# Altium schematic sheet ATmega328-ED.SchDoc: ATmega328 ED
size B; Author: Quadro; Revision: 1.0.0; SheetNumber: 1; SheetTotal: 1
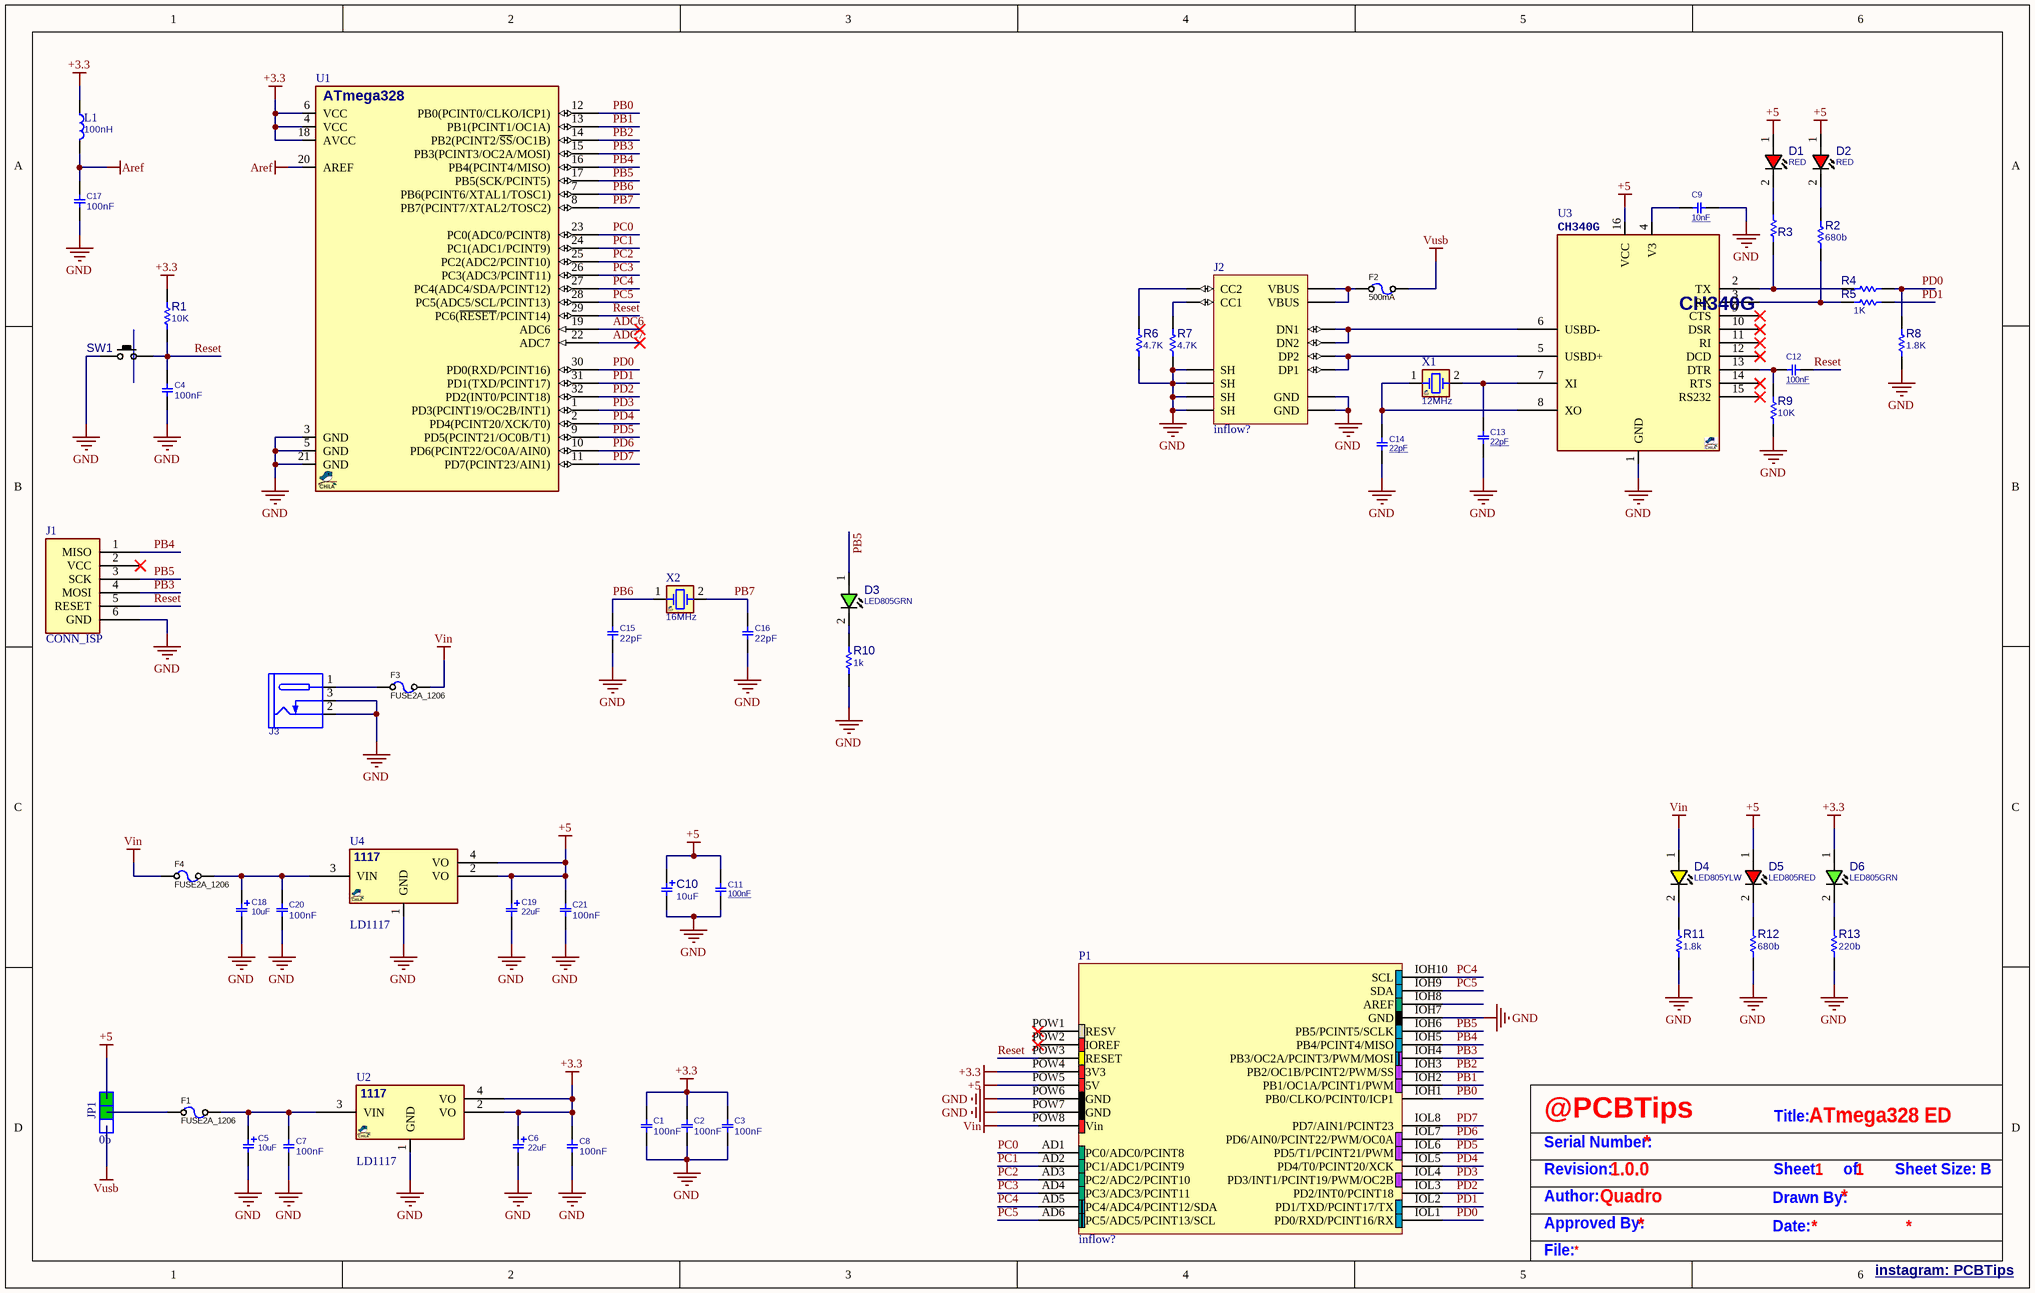
[diagram p0: ATmega328-ED.SchDoc]

## Parts
C1  100nF  [C0805]
C2  100nF  [C0805]
C3  100nF  [C0805]
C4  100nF  [C0805]
C5  10uF  [C_TN_2012]
C6  22uF  [C_TN_2012]
C7  100nF  [C1206]
C8  100nF  [C1206]
C9  10nF  [C1206]
C10  10uF  [C_EL_D4L5]
C11  100nF  [C1206]
C12  100nF  [C1206]
C13  22pF  [C1206]
C14  22pF  [C1206]
C15  22pF  [C0805]
C16  22pF  [C0805]
C17  100nF  [C0805]
C18  10uF  [C_TN_2012]
C19  22uF  [C_TN_2012]
C20  100nF  [C1206]
C21  100nF  [C1206]
D1  RED  [LED0805RED]
D2  RED  [LED0805RED]
D3  LED805GRN  [LED0805GRN]
D4  LED805YLW  [LED0805YLW]
D5  LED805RED  [LED0805RED]
D6  LED805GRN  [LED0805GRN]
F1  FUSE2A_1206  [F1206]
F2  500mA  [F1206]
F3  FUSE2A_1206  [F1206]
F4  FUSE2A_1206  [F1206]
J1  CONN_ISP  [IDC_2X3]
J2  Inflow: inflow?  [HRO_TYPE-C-31-M-12 - Extended]  (hidden comment: 12b)
J3  DC_POWER_JACK  [JAC_PWR2]  (value not drawn)
JP1  0b  [jumper selector]
L1  100nH  [L0805]
P1  Inflow: inflow?  [ARDUINO_UNO_CONNECTOR]  (hidden comment: UNO)
R1  10K  [R0805]
R2  680b  [R0805]
R3  680b  [R0805]  (value not drawn)
R4  1K  [R0805]  (value not drawn)
R5  1K  [R0805]
R6  4.7K  [R0805]
R7  4.7K  [R0805]
R8  1.8K  [R0805]
R9  10K  [R0805]
R10  1k  [R0805]
R11  1.8k  [R0805]
R12  680b  [R0805]
R13  220b  [R0805]
SW1  PUSHBUTTON  [SWPBS_SPST_6X3X2]  (value not drawn)
U1  ATMEGA328  [QFG80_32]  (value not drawn)
U2  LD1117  [SOT223_4]
U3  CH340G  [SO_16]
U4  LD1117  [SOT223_4]
X1  12MHz  [XTL_2_11X5]
X2  16MHz  [XTL_2_11X5]

## Nets
+3.3: C1.2 C2.2 C3.2 C6.1 C8.1 D6.1(ANODE) L1.1 P1.POW4(3V3) R1.2 U1.4(VCC) U1.6(VCC) U1.18(AVCC) U2.2(VO) U2.4(VO)
+5: C10.1 C11.2 C19.1 C21.1 D1.1(ANODE) D2.1(ANODE) D5.1(ANODE) JP1.1 P1.POW5(5V) U3.16(VCC) U4.2(VO) U4.4(VO)
Aref: C17.2 L1.2 U1.20(AREF)
GND: C1.1 C2.1 C3.1 C4.1 C5.2 C6.2 C7.2 C8.2 C9.1 C10.2 C11.1 C13.1 C14.1 C15.1 C16.1 C17.1 C18.2 C19.2 C20.2 C21.2 J1.6(GND) J2.A1_B12(GND) J2.B1_A12(GND) J2.S1(SH) J2.S2(SH) J2.S3(SH) J2.S4(SH) J3.2(SLEEVE) J3.3(INSERTION_DET) P1.IOH7(GND) P1.POW6(GND) P1.POW7(GND) R6.1 R7.1 R8.1 R9.1 R10.1 R11.1 R12.1 R13.1 SW1.1(P1) U1.3(GND) U1.5(GND) U1.21(GND) U2.1(GND) U3.1(GND) U4.1(GND)
Vin: D4.1(ANODE) F3.2 F4.1 P1.POW8(Vin)
Vusb: F2.2 JP1.3
ADC6: U1.19(ADC6)
ADC7: U1.22(ADC7)
PB0: P1.IOH1(PB0/CLKO/PCINT0/ICP1) U1.12(PB0(PCINT0/CLKO/ICP1))
PB1: P1.IOH2(PB1/OC1A/PCINT1/PWM) U1.13(PB1(PCINT1/OC1A))
PB2: P1.IOH3(PB2/OC1B/PCINT2/PWM/SS) U1.14(PB2(PCINT2/~{SS}/OC1B))
PB3: J1.4(MOSI) P1.IOH4(PB3/OC2A/PCINT3/PWM/MOSI) U1.15(PB3(PCINT3/OC2A/MOSI))
PB4: J1.1(MISO) P1.IOH5(PB4/PCINT4/MISO) U1.16(PB4(PCINT4/MISO))
PB5: D3.1(ANODE) J1.3(SCK) P1.IOH6(PB5/PCINT5/SCLK) U1.17(PB5(SCK/PCINT5))
PB6: C15.2 U1.7(PB6(PCINT6/XTAL1/TOSC1)) X2.1(OSC1)
PB7: C16.2 U1.8(PB7(PCINT7/XTAL2/TOSC2)) X2.2(OSC2)
PC0: P1.AD1(PC0/ADC0/PCINT8) U1.23(PC0(ADC0/PCINT8))
PC1: P1.AD2(PC1/ADC1/PCINT9) U1.24(PC1(ADC1/PCINT9))
PC2: P1.AD3(PC2/ADC2/PCINT10) U1.25(PC2(ADC2/PCINT10))
PC3: P1.AD4(PC3/ADC3/PCINT11) U1.26(PC3(ADC3/PCINT11))
PC4: P1.AD5(PC4/ADC4/PCINT12/SDA) P1.IOH10(SCL) U1.27(PC4(ADC4/SDA/PCINT12))
PC5: P1.AD6(PC5/ADC5/PCINT13/SCL) P1.IOH9(SDA) U1.28(PC5(ADC5/SCL/PCINT13))
PD0: P1.IOL1(PD0/RXD/PCINT16/RX) R4.2 R8.2 U1.30(PD0(RXD/PCINT16))
PD1: P1.IOL2(PD1/TXD/PCINT17/TX) R5.2 U1.31(PD1(TXD/PCINT17))
PD2: P1.IOL3(PD2/INT0/PCINT18) U1.32(PD2(INT0/PCINT18))
PD3: P1.IOL4(PD3/INT1/PCINT19/PWM/OC2B) U1.1(PD3(PCINT19/OC2B/INT1))
PD4: P1.IOL5(PD4/T0/PCINT20/XCK) U1.2(PD4(PCINT20/XCK/T0))
PD5: P1.IOL6(PD5/T1/PCINT21/PWM) U1.9(PD5(PCINT21/OC0B/T1))
PD6: P1.IOL7(PD6/AIN0/PCINT22/PWM/OC0A) U1.10(PD6(PCINT22/OC0A/AIN0))
PD7: P1.IOL8(PD7/AIN1/PCINT23) U1.11(PD7(PCINT23/AIN1))
Reset: C4.2 C12.1 J1.5(RESET) P1.POW3(RESET) R1.1 SW1.2(P3) U1.29(PC6(~{RESET}/PCINT14))
NetC5_1: C5.1 C7.1 F1.2 U2.3(VIN)
NetC9_2: C9.2 U3.4(V3)
NetC12_2: C12.2 R9.2 U3.13(DTR)
NetC13_2: C13.2 U3.7(XI) X1.2(OSC2)
NetC14_2: C14.2 U3.8(XO) X1.1(OSC1)
NetC18_1: C18.1 C20.1 F4.2 U4.3(VIN)
NetD1_2: D1.2(CATHODE) R3.2
NetD2_2: D2.2(CATHODE) R2.2
NetD3_2: D3.2(CATHODE) R10.2
NetD4_2: D4.2(CATHODE) R11.2
NetD5_2: D5.2(CATHODE) R12.2
NetD6_2: D6.2(CATHODE) R13.2
NetF1_1: F1.1 JP1.2
NetF2_1: F2.1 J2.A4_B9(VBUS) J2.B4_A9(VBUS)
NetF3_1: F3.1 J3.1(TIP)
NetJ2_A5: J2.A5(CC1) R7.2
NetJ2_A6: J2.A6(DP1) J2.B6(DP2) U3.5(USBD+)
NetJ2_A7: J2.A7(DN1) J2.B7(DN2) U3.6(USBD-)
NetJ2_B5: J2.B5(CC2) R6.2
NetR2_1: R2.1 R5.1 U3.3(RX)
NetR3_1: R3.1 R4.1 U3.2(TX)

Not connected (* = marked no-connect by the designer): J1 2(VCC)*; P1 IOH8(AREF) POW1(RESV)* POW2(IOREF)*; U3 9(CTS)* 10(DSR)* 11(RI)* 12(DCD)* 14(RTS)* 15(RS232)*

## Notes on the sheet
- Serial Number:
- Revision:
- @PCBTips
- Sheet       of
- Title:
- Sheet Size: B
- Author:
- Approved By:
- Date:
- Drawn By:
- File:
- instagram: PCBTips <https://www.instagram.com/pcbtips>
- (in symbol ATMEGA328_QFP32) ATmega328
- (in symbol VREG_1117_SOT223) 1117

## Library data of the parts
C1-C4 C15-C17 = CAP_SMD_MLCC_0805: CAP, MLCC; PARAM: -, -%; MANF_P#: MANF_PART#; PARAM2: -V; PRICE: 100= 1$; MANF: -; ASSEMBLY: ASSEMBLY
  C1-C4 C17: VALUE: 100nF
  C15 C16: VALUE: 22pF
C5 C6 C18 C19 = CAP_SMD_TAN_4: CAP, SMD, TAN; PARAM: 20%, 300mOhm, -55~105oC; MANF: VISHAY; MANF_P#: T55A106M6R3C0300; PARAM2: 6.3V; PRICE: 0.46$
  C5 C18: VALUE: 10uF
  C6 C19: VALUE: 22uF
C7 C8 C20 C21 = CAP_SMD_MLCC_1206: CAP, MLCC; PARAM: -, -%; MANF_P#: MANF_PART#; PARAM2: -V; PRICE: 100= 1$; MANF: -; ASSEMBLY: ASSEMBLY; VALUE: 100nF
C9 C11-C14 = CAP_SMD_FILM: CAP, FILM, 680nF, 16V, Acryl, 20%, 1206; PARAM: Acrylic, MetallizedStacked, 20%, -40~85oC; MANF: Murata; PRICE: 100= 40$; DESC: -; MANF_P#: -; PARAM2: 16V; ASSEMBLY: ASSEMBLY
  C9: VALUE: 10nF
  C11 C12: VALUE: 100nF
  C13 C14: VALUE: 22pF
C10 = CAP_SMD_EL: CAP, SMD, ELEC,; MANF_P#: MANF_PART#; PARAM2: -V; DESC: DESCRIPTION; DIST#: MOUSER; PARAM: 20%; PRICE: 10= -$; MANF: MANF; ASSEMBLY: ASSEMBLY; VALUE: 10uF
D1 D2 D5 = LED_SMD_0805_RED: LED, SMD, 0805, RED; DESC: DESCRIPTION; MANF_P#: MANF_PART#; PARAM2: 2.2V; MANF: MANF; ASSEMBLY: ASSEMBLY; PRICE: 36t@Javan
  D1 D2: VALUE: RED
  D5: VALUE: LED805RED
D3 D6 = LED_SMD_0805_GRN: LED, SMD, 0805, GREEN; PARAM: 20mA; DESC: DESCRIPTION; PARAM2: 2.2V; MANF: -; ASSEMBLY: ASSEMBLY; PRICE: 36t@Javan; MANF_P#: -; VALUE: LED805GRN
D4 = LED_SMD_0805_YLW: LED, SMD, 0805, YELLOW; DESC: DESCRIPTION; MANF_P#: MANF_PART#; PARAM2: 2.2V; MANF: MANF; ASSEMBLY: ASSEMBLY; PRICE: 36t@Javan; VALUE: LED805YLW
F1 F3 F4 = FUSE_3A_1206_SLOW: Fuse, 3A, 32VDC, 1206, SMD, Slow Blow; PARAM: 0.5A; MANF: Bourns; MANF_P#: SF-1206SP300-2; PARAM2: 0.027Ohm; PRICE: 0.9$; VALUE: FUSE2A_1206
F2 = FUSE_3A_1206_SLOW: Fuse, 3A, 32VDC, 1206, SMD, Slow Blow; PARAM: 3A; 32VDC; Slow Blow; MANF: Bourns; MANF_P#: SF-1206SP300-2; PARAM2: 0.027Ohm; PRICE: 0.9$; VALUE: 500mA
J1 = CONN_AVR_ISP_IDC6: CONN, ISP, AVR , HEADER BOX; VALUE: CONN_ISP
J2 = Con_USB_C: USB C Female Connector; Rating: Rating?; Validation: Valid; Value: 12b; Package: SMD; Type: C
J3 = CONN_PWR_JACKR2: CONN, PWR JACK DC, PLUG DIAM 2.0MM RA THD; MANF: CUI STACK; MANF_P#: PJ-202A, PJ-002AH, PJ-102AH, KLDX-0202; VALUE: DC_POWER_JACK
JP1 = SW_Other_JSelector_Dip: Jumper Selector; Rating: Rating?; Inflow: 5145; Validation: NT; Package: Dip; Type: Selector; Value: 0b
L1 = IND_SMD_330nH_0.2A: INDUCTOR, SMD; MANF: EPCOS / TDK; MANF_P#: B82498F3331J; PARAM: 220mA, 1.5Ohm, -55~105oC; PRICE: 0.8$; VALUE: 100nH
P1 = Con_Arduino_UNO_Con: Arduino UNO Connector; Rating: Rating?; Validation: NT; Value: UNO; Package: Package?; Type: Type?
R1-R13 = RES_SMD_0805: RESISTOR, SMD; PARAM: -W; DESC: DESCRIPTION; DIST#: MOUSER; PARAM2: 1%; MANF_P#: -; MANF: -; ASSEMBLY: ASSEMBLY; PRICE: 100= 0.5$
  R1 R9: VALUE: 10K
  R2 R3 R12: VALUE: 680b
  R4 R5: VALUE: 1K
  R6 R7: VALUE: 4.7K
  R8: VALUE: 1.8K
  R10: VALUE: 1k
  R11: VALUE: 1.8k
  R13: VALUE: 220b
SW1 = SWPBS_SPST_6X3X2_RS282: SWITCH, PUSH BUTTON, TACTILE, SMD, SPST, 6X3.5X2.5mm; MANF: C&K; DESC: DESCRIPTION; MANF_P#: RS-282G05A3-SM RT; VALUE: PUSHBUTTON; ASSEMBLY: ASSEMBLY; PARAM: PARAM; PRICE: 0.8$
U1 = ATMEGA328_QFP32: MCU, AVR, 8-Bit, 16KB, 1KB RAM, 20MHz; PART#ALT: ATmega8-48-88-168-328; MANF_P#: ATMEGA328-AU; DESC: 1KB EEPROM; MANF: ATMEL/MICROCHIP; PARAM2: 1.8~5.5V; PARAM: 32KB, 2KB RAM, 20MHz, -40~85°C; PRICE: 2.2$; VALUE: ATMEGA328
U2 U4 = VREG_1117_SOT223: REG, Linear, LDO1V, 0.8A, SOT-223; MANF_P#: LD1117, LM1117, AMS1117, TLV1117, REG1117, NCP1117, LT1117, SPX1117; MANF: TI, ON, ST; PARAM2: 1.2/1.5/1.8/2.5/2.85/3.3/5V; PARAM: LDO1V, 0.8A; VALUE: LD1117
U3 = CH340G_SOP16: USB-UART; MANF_P#: CH340G; VALUE: CH340G
X1 = XTL_2_HC49_8MHz_SMD: Crystal MOST POPULAR ABL HC49 PACKAGE; MANF: ABRACON; MANF_P#: ABLS-8.000MHZ-B4-T; PARAM: 8MHz, 18pF, 30PPM, -20~70oC; PRICE: 0.3$; VALUE: 12MHz
X2 = XTL_2_HC49_SMD: Crystal MOST POPULAR ABL HC49 PACKAGE; VALUE: 16MHz